# Altium schematic sheet com.SchDoc
size A4
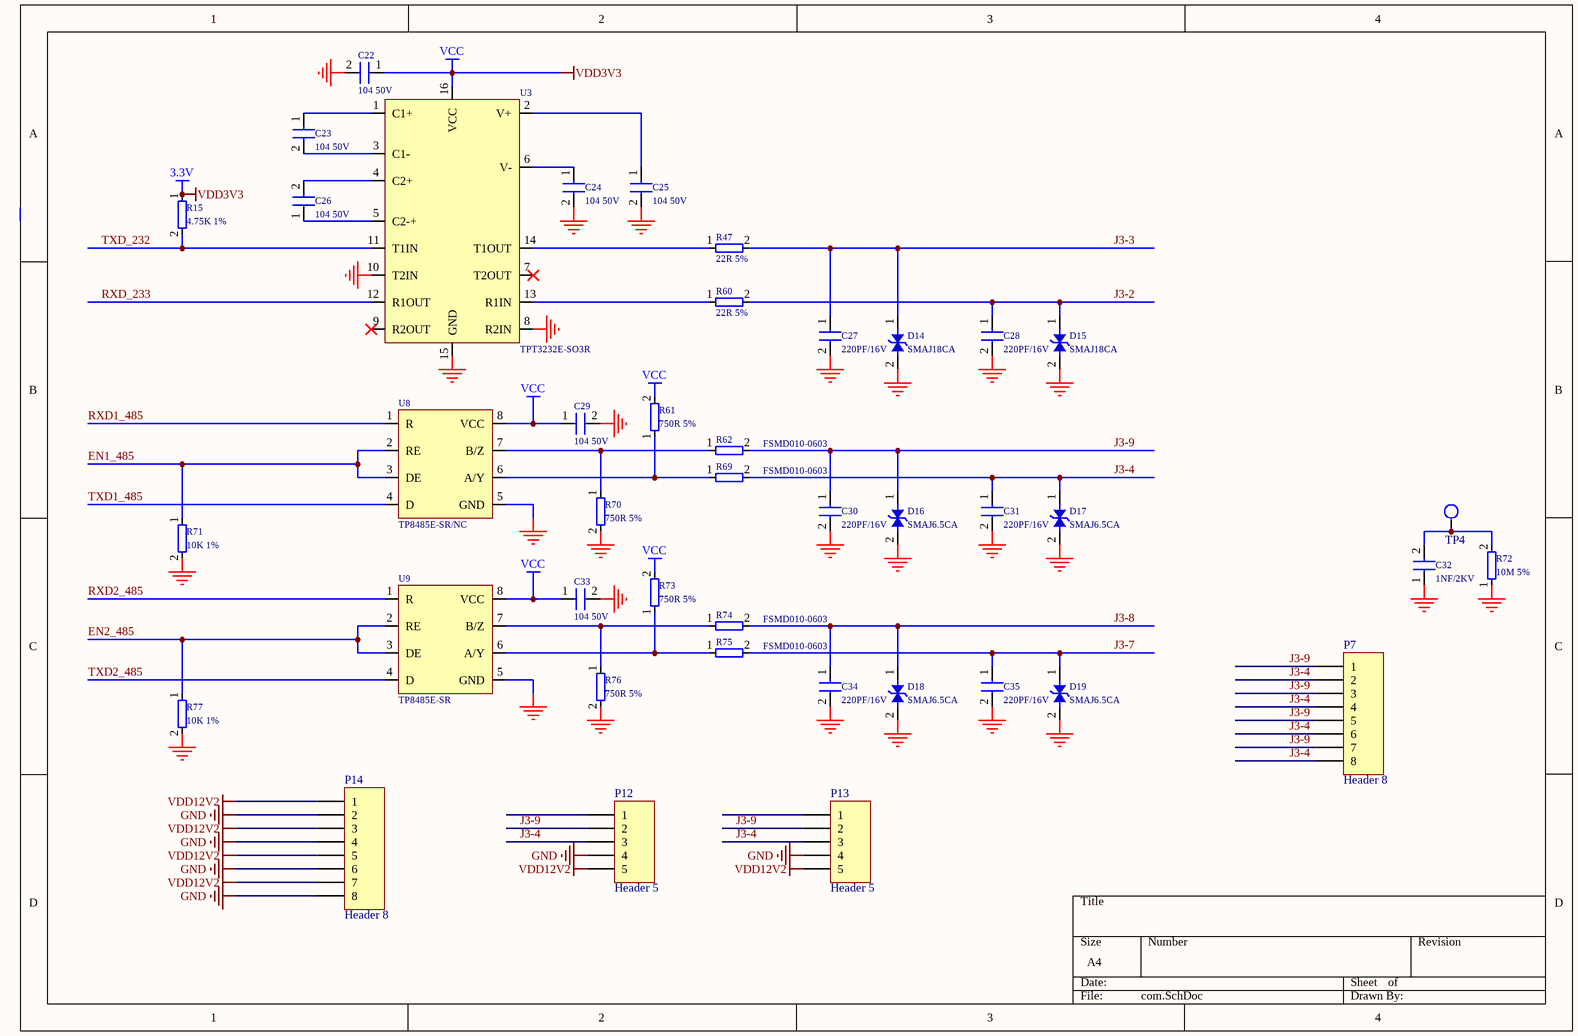
[diagram p0: com.SchDoc]

## Parts
C22  104 50V  [0603C]
C23  104 50V  [0603C]
C24  104 50V  [0603C]
C25  104 50V  [0603C]
C26  104 50V  [0603C]
C27  220PF/16V  [0603C]
C28  220PF/16V  [0603C]
C29  104 50V  [0603C]
C30  220PF/16V  [0603C]
C31  220PF/16V  [0603C]
C32  1NF/2KV  [1206C]
C33  104 50V  [0603C]
C34  220PF/16V  [0603C]
C35  220PF/16V  [0603C]
D14  SMAJ18CA  [SMA]
D15  SMAJ18CA  [SMA]
D16  SMAJ6.5CA  [SMA]
D17  SMAJ6.5CA  [SMA]
D18  SMAJ6.5CA  [SMA]
D19  SMAJ6.5CA  [SMA]
P7  Header 8  [8X2.54MMZ]
P12  Header 5  [5X2.54MMZ]
P13  Header 5  [5X2.54MMZ]
P14  Header 8  [8X2.54MMZ]
R15  4.75K 1%  [0603R]
R47  22R 5%  [0603R]
R60  22R 5%  [0603R]
R61  750R 5%  [0603R]
R62  FSMD010-0603  [0603R]
R69  FSMD010-0603  [0603R]
R70  750R 5%  [0603R]
R71  10K 1%  [0603R]
R72  10M 5%  [1206r]
R73  750R 5%  [0603R]
R74  FSMD010-0603  [0603R]
R75  FSMD010-0603  [0603R]
R76  750R 5%  [0603R]
R77  10K 1%  [0603R]
TP4  TPS  [tpd]  (value not drawn)
U3  TPT3232E-SO3R  [SO-16Z]
U8  TP8485E-SR/NC  [SO-8]
U9  TP8485E-SR  [SO-8]

## Nets
3.3V: C22.1 C29.1 C33.1 R15.1 R61.2 R73.2 U3.16(VCC) U8.8(VCC) U9.8(VCC)  [also labelled VCC, VDD3V3]
GND: C22.2 C24.2 C25.2 C27.2 C28.2 C29.2 C30.2 C31.2 C32.1 C33.2 C34.2 C35.2 D14.2 D15.2 D16.2 D17.2 D18.2 D19.2 P12.4 P13.4 P14.2 P14.4 P14.6 P14.8 R70.2 R71.2 R72.1 R76.2 R77.2 U3.8(R2IN) U3.10(T2IN) U3.15(GND) U8.5(GND) U9.5(GND)
VDD12V2: P12.5 P13.5 P14.1 P14.3 P14.5 P14.7
EN1_485: R71.1 U8.2(RE) U8.3(DE)
EN2_485: R77.1 U9.2(RE) U9.3(DE)
J3-2: C28.1 D15.1 R60.2
J3-3: C27.1 D14.1 R47.2
J3-4: C31.1 D17.1 P7.2 P7.4 P7.6 P7.8 P12.3 P13.3 R69.2
J3-7: C35.1 D19.1 R75.2
J3-8: C34.1 D18.1 R74.2
J3-9: C30.1 D16.1 P7.1 P7.3 P7.5 P7.7 P12.2 P13.2 R62.2
RXD1_485: U8.1(R)
RXD2_485: U9.1(R)
RXD_233: U3.12(R1OUT)
TXD1_485: U8.4(D)
TXD2_485: U9.4(D)
TXD_232: R15.2 U3.11(T1IN)
NetC23_1: C23.1 U3.1(C1+)
NetC23_2: C23.2 U3.3(C1-)
NetC24_1: C24.1 U3.6(V-)
NetC25_1: C25.1 U3.2(V+)
NetC26_1: C26.1 U3.5(C2-+)
NetC26_2: C26.2 U3.4(C2+)
NetC32_2: C32.2 R72.2 TP4.1
NetR47_1: R47.1 U3.14(T1OUT)
NetR60_1: R60.1 U3.13(R1IN)
NetR61_1: R61.1 R69.1 U8.6(A/Y)
NetR62_1: R62.1 R70.1 U8.7(B/Z)
NetR73_1: R73.1 R75.1 U9.6(A/Y)
NetR74_1: R74.1 R76.1 U9.7(B/Z)

Not connected (* = marked no-connect by the designer): P12 1; P13 1; U3 7(T2OUT)* 9(R2OUT)*

## Library data of the parts
C22-C35 = CAP
D14-D19 = D_ESD
P7 P14 = Header 8: Header, 8-Pin; LatestRevisionDate: 17-Jul-2002; LatestRevisionNote: Re-released for DXP Platform.; Publisher: Altium Limited
P12 P13 = Header 5: Header, 5-Pin; LatestRevisionDate: 17-Jul-2002; LatestRevisionNote: Re-released for DXP Platform.; Publisher: Altium Limited
R15 R47 R60-R62 R69-R77 = RES
U8 = TP8485E-SR